# Altium schematic sheet BTL_POWER.SchDoc: BTL_SmartHome
size A4; Organization: HCMUT; Address1: 268 Ly Thuong Kiet; Address2: Dien Hong Ward; Address3: HCMC; Address4: (+84) 98 380 3257; SheetNumber: 2; SheetTotal: 3
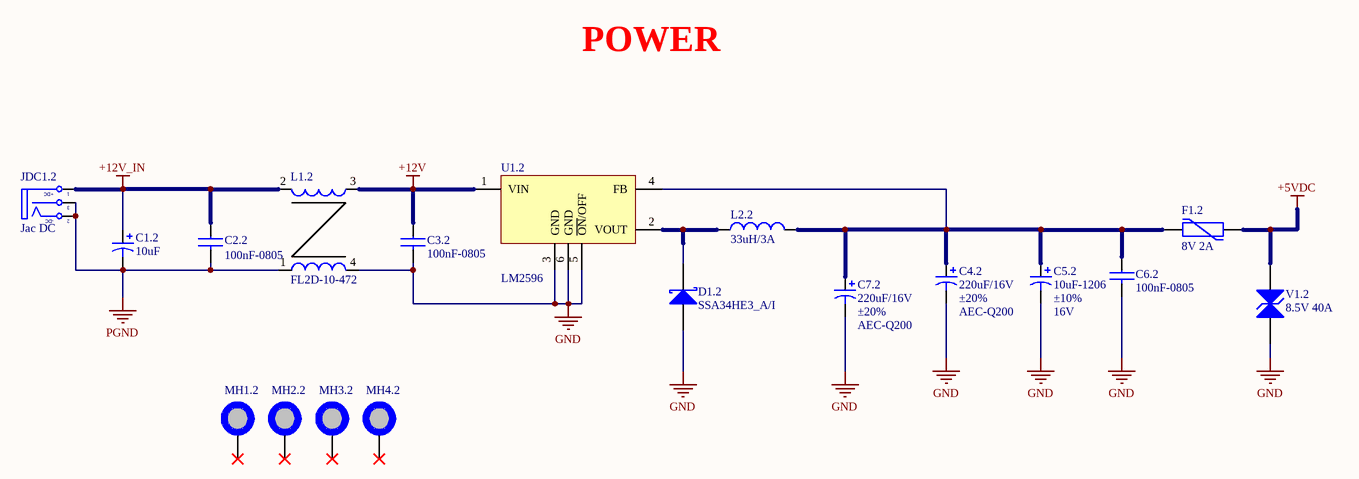
[diagram p0: BTL_POWER.SchDoc]

## Parts
C1.2  10uF  [CAP_ALUMINUM_D8]
C2.2  100nF-0805  [CAP0805]
C3.2  100nF-0805  [CAP0805]
C4.2  220uF/16V  Tolerance: ±20%  Ratings: AEC-Q200  [CAP_ALUMINUM_D8]
C5.2  10uF-1206  Tolerance: ±10%  Voltage - Rated: 16V  [CAP1206_TANTALUM_YELLOW]
C6.2  100nF-0805  [CAP0805]
C7.2  220uF/16V  Tolerance: ±20%  Ratings: AEC-Q200  [CAP_ALUMINUM_D8]
D1.2  SSA34HE3_A/I  [DO-214AC]
F1.2  8V 2A  [FUSE_PTC_SMD1812_03]
JDC1.2  Jac DC  [DC-IN]
L1.2  FL2D-10-472  [INDC_FL2D-10-472]
L2.2  33uH/3A  [INDC_CDRH8D28]
MH1.2  MH_5MMC_3.2MMD  [MH_5MMD_3.2MMD]  (value not drawn)  (no BOM)
MH2.2  MH_5MMC_3.2MMD  [MH_5MMD_3.2MMD]  (value not drawn)  (no BOM)
MH3.2  MH_5MMC_3.2MMD  [MH_5MMD_3.2MMD]  (value not drawn)  (no BOM)
MH4.2  MH_5MMC_3.2MMD  [MH_5MMD_3.2MMD]  (value not drawn)  (no BOM)
U1.2  LM2596  [TO263-5]
V1.2  8.5V 40A  [INDC0805]

## Nets
+5VDC: F1.2.2 V1.2.1
+12V: C3.2.1 L1.2.3 U1.2.1(VIN)
+12V_IN: C1.2.1 C2.2.1 JDC1.2.1(T) L1.2.2
GND: C3.2.2 C4.2.2 C5.2.2 C6.2.2 C7.2.2 D1.2.1(A) L1.2.4 U1.2.3(GND) U1.2.5(~{ON}/OFF) U1.2.6(GND) V1.2.2
PGND: C1.2.2 C2.2.2 JDC1.2.2(TN) JDC1.2.3(S) L1.2.1
NetC4.2_1: C4.2.1 C5.2.1 C6.2.1 C7.2.1 F1.2.1 L2.2.2 U1.2.4(FB)
NetD1.2_2: D1.2.2(K) L2.2.1 U1.2.2(VOUT)

Not connected (* = marked no-connect by the designer): MH1.2 1*; MH2.2 1*; MH3.2 1*; MH4.2 1*

## Notes on the sheet
- POWER
- Title
- Size:
- Date:
- Author:
- A4
- Number:
- Time:
- Checked:
- Revision:
- Sheet
- Approved:
- of
- File:
- (in symbol DCIN) +DC; -DC

## Library data of the parts
C1.2 C4.2 C7.2 = EEE-FK1C470P: CAP ALUM 47UF 20% 16V SMD; Manufacturer: Panasonic Electronic Components; Lifetime @ Temp.: 2000 Hrs @ 105°C; Polarization: Polar; Surface Mount Land Size: 0.260" L x 0.260" W (6.60mm x 6.60mm); Supplier 1: Digi-Key; Manufacturer Part Number: EEE-FK1C470P; RoHS: RoHS Compliant; Category: Capacitors; Stock 1: 97208; Pricing 1: 1=0.51, 10=0.354, 100=0.2123, 500=0.1592 (USD); Packaging: Digi-Reel®; Part Status: Active; ESR (Equivalent Series Resistance): -; Operating Temperature: -55°C ~ 105°C; Applications: Automotive; Lead Spacing: -; Size / Dimension: 0.248" Dia (6.30mm); Height - Seated (Max): 0.240" (6.10mm); Mounting Type: Surface Mount; Package / Case: Radial, Can - SMD; ComponentLink1URL: http://industrial.panasonic.com/www-cgi/jvcr13pz.cgi?E+PZ+3+ABA0120+EEEFK1C470P+7+WW; ComponentLink1Description: http://industrial.panasonic.com/www-cgi/jvcr13pz.cgi?E+PZ+3+ABA0120+EEEFK1C470P+7+WW; Supplier Part Number 1: PCE3790DKR-ND; Value: 47uF
C2.2 C3.2 C6.2 = CC0805JRNPO9BN300: CAP CER 30PF 50V NPO 0805; Manufacturer: Yageo; Tolerance: ±5%; Temperature Coefficient: C0G, NP0; Notification: Current market demand for these product types have resulted in fluctuating and extending lead times. Lead times may differ.; Supplier 1: Digi-Key; Manufacturer Part Number: CC0805JRNPO9BN300; RoHS: RoHS Compliant; Category: Capacitors; Stock 1: 0; Pricing 1: 1=0.15, 10=0.107, 100=0.0503, 500=0.03524, 1000=0.02918 (USD); Packaging: Cut Tape (CT); Part Status: Active; Voltage - Rated: 50V; Operating Temperature: -55°C ~ 125°C; Features: High Voltage; Ratings: -; Applications: General Purpose; Failure Rate: -; Mounting Type: Surface Mount, MLCC; Package / Case: 0805 (2012 Metric); Size / Dimension: 0.079" L x 0.049" W (2.00mm x 1.25mm); Height - Seated (Max): -; Thickness (Max): 0.028" (0.70mm); Lead Spacing: -; Lead Style: -; ComponentLink1URL: http://www.yageo.com/documents/recent/UPY-GP_NP0_16V-to-50V_16.pdf; ComponentLink1Description: http://www.yageo.com/documents/recent/UPY-GP_NP0_16V-to-50V_16.pdf; Supplier Part Number 1: 311-4234-1-ND
C5.2 = T491A106K016AT: CAP TANT 10UF 16V 10% 1206; Manufacturer 1: KEMET; Manufacturer Size Code: A; Category 1: Capacitors; Capacitance: 10µF; Type: Molded; ESR (Equivalent Series Resistance): 7 Ohm; Lifetime @ Temp.: 2000 Hrs @ 85°C; Supplier 1: Digi-Key; Supplier Part Number 1: 399-8269-1-ND; Manufacturer Part Number 1: T491A106K016AT; RoHS 1: RoHS Compliant; Description 1: CAP TANT 10UF 16V 10% 1206; Stock 1: 54083; Pricing 1: 1=0.45, 10=0.312, 100=0.1873, 500=0.14048, 1000=0.11862 (USD); Packaging: Cut Tape (CT); Part Status: Active; Operating Temperature: -55°C ~ 125°C; Mounting Type: Surface Mount; Package / Case: 1206 (3216 Metric); Size / Dimension: 0.126" L x 0.063" W (3.20mm x 1.60mm); Height - Seated (Max): 0.071" (1.80mm); Lead Spacing: -; Features: General Purpose; Failure Rate: -; ComponentLink1URL: http://www.kemet.com/Lists/ProductCatalog/Attachments/254/KEM_T2005_T491.pdf; ComponentLink1Description: http://www.kemet.com/Lists/ProductCatalog/Attachments/254/KEM_T2005_T491.pdf; Value: 10uF
D1.2 = DIODE_SSA34HE3_A/I: DIODE SCHOTTKY 40V 3A DO214AC; Manufacturer 1: Vishay Semiconductor Diodes Division; Category 1: Discrete Semiconductor Products; Voltage - Forward (Vf) (Max) @ If: 490mV @ 3A; Speed: Fast Recovery =< 500ns, > 200mA (Io); Current - Reverse Leakage @ Vr: 200µA @ 40V; Supplier 1: Digi-Key; Supplier Part Number 1: SSA34HE3_A/I-ND; Manufacturer Part Number 1: SSA34HE3_A/I; RoHS 1: RoHS Compliant; Description 1: DIODE SCHOTTKY 40V 3A DO214AC; Stock 1: 0; Pricing 1: 7500=0.13508 (USD); Packaging: Tape & Reel (TR); Part Status: Active; Diode Type: Schottky; Voltage - DC Reverse (Vr) (Max): 40V; Current - Average Rectified (Io): 3A; Capacitance @ Vr, F: -; Mounting Type: Surface Mount; Package / Case: DO-214AC, SMA; Supplier Device Package: DO-214AC (SMA); Operating Temperature - Junction: -65°C ~ 150°C; ComponentLink1URL: http://www.vishay.com/docs/88883/ssa33l.pdf; ComponentLink1Description: http://www.vishay.com/docs/88883/ssa33l.pdf
F1.2 = FUSE_MF-MSMF200-2: PTC RESET FUSE 8V 2A 1812; Manufacturer: Bourns; Number of Terminals/Pins: 2; Max Current Rating: 40A; Power Dissipation: 800mW; Trip Current: 4A; Resistance: 80mR; Time to Trip: 3s; Aging: 1000 hr @ +85 °C (Passive); Approvals: UL,CSA,TUV; Supplier 1: Digi-Key; Supplier Part Number 1: MF-MSMF200-2CT-ND; Manufacturer Part Number: MF-MSMF200-2; RoHS: Yes; Category: Fuses; Stock 1: 15085; Pricing 1: 1=0.67000, 5=0.65000, 10=0.63000, 50=0.53000, 100=0.44000, 250=0.40000, 500=0.33998, 1000=0.29998 (USD); Mount: PCB,Surface Mount; Case/Package: 1812; Number of Pins: 2; Case Code (Metric): 4532; Case Code (Imperial): 1812; Terminal Material: Gold; Min Operating Temperature: -40°C; Max Operating Temperature: 85°C; Hold Current: 2A; Current Rating: 40A; Package Quantity: 2000; Packaging: Tape and Reel; Operating Supply Voltage: 8V; Voltage Rating: 8V; Termination: SMD/SMT; Max Power Dissipation: 800mW; Voltage Rating (DC): 8V; Series: MF-MSMF; Length: 4.73mm; Width: 3.41mm; Height: 0.85mm; Radiation Hardening: No; REACH SVHC: No SVHC; Lead Free: Lead Free; RoHS Compliant: Yes; ComponentLink1URL: https://datasheet.ciiva.com/326/mfmsmf-326966.pdf?src-supplier=Digi-Key; ComponentLink1Description: https://datasheet.ciiva.com/326/mfmsmf-326966.pdf?src-supplier=Digi-Key; ComponentLink2URL: https://datasheet.ciiva.com/326/mfmsmf-326967.pdf?src-supplier=Digi-Key; ComponentLink2Description: https://datasheet.ciiva.com/326/mfmsmf-326967.pdf?src-supplier=Digi-Key; ComponentLink3URL: https://datasheet.ciiva.com/1274/1786007-1274556.pdf?src-supplier=Element14; ComponentLink3Description: https://datasheet.ciiva.com/1274/1786007-1274556.pdf?src-supplier=Element14; ComponentLink4URL: https://datasheet.ciiva.com/1228/1786007-1228163.pdf?src-supplier=Newark; ComponentLink4Description: https://datasheet.ciiva.com/1228/1786007-1228163.pdf?src-supplier=Newark; ComponentLink5URL: https://datasheet.ciiva.com/3020/mfmsmf-3020419.pdf?src-supplier=Avnet; ComponentLink5Description: https://datasheet.ciiva.com/3020/mfmsmf-3020419.pdf?src-supplier=Avnet; ComponentLink6URL: https://datasheet.ciiva.com/326/mfmsmf-326968.pdf?src-supplier=Digi-Key; ComponentLink6Description: https://datasheet.ciiva.com/326/mfmsmf-326968.pdf?src-supplier=Digi-Key; ComponentLink7URL: https://datasheet.ciiva.com/16692/mfmsmf-16692201.pdf?src-supplier=Avnet+Europe; ComponentLink7Description: https://datasheet.ciiva.com/16692/mfmsmf-16692201.pdf?src-supplier=Avnet+Europe; ComponentLink8URL: https://datasheet.ciiva.com/3019/mfmsmf-3019786.pdf?src-supplier=Avnet; ComponentLink8Description: https://datasheet.ciiva.com/3019/mfmsmf-3019786.pdf?src-supplier=Avnet; ComponentLink9URL: https://datasheet.ciiva.com/28411/1786007-28411578.pdf?src-supplier=Element14; ComponentLink9Description: https://datasheet.ciiva.com/28411/1786007-28411578.pdf?src-supplier=Element14; ComponentLink10URL: https://datasheet.ciiva.com/15187/getdatasheetpartid-117210-15187148.pdf?src-supplier=Verical; ComponentLink10Description: https://datasheet.ciiva.com/15187/getdatasheetpartid-117210-15187148.pdf?src-supplier=Verical; ComponentLink11URL: https://datasheet.ciiva.com/1274/1786007-1274557.pdf?src-supplier=Element14; ComponentLink11Description: https://datasheet.ciiva.com/1274/1786007-1274557.pdf?src-supplier=Element14; ComponentLink12URL: https://datasheet.ciiva.com/30196/575mfmsmf-30196429.pdf?src-supplier=Onlinecomponents.com; ComponentLink12Description: https://datasheet.ciiva.com/30196/575mfmsmf-30196429.pdf?src-supplier=Onlinecomponents.com
JDC1.2 = DCIN: Jac DC input; Value: Jac DC
L1.2 = IND_FL2D-10-472: 4.7uH, 1A
L2.2 = IND_CDRH8D28NP-100NC: FIXED IND 10UH 3.2A 47 MOHM SMD; Manufacturer: Sumida America Components Inc.; Material - Core: Ferrite; Tolerance: ±30%; Shielding: Shielded; DC Resistance (DCR): 47 mOhm Max; Supplier 1: Digi-Key; Manufacturer Part Number: CDRH8D28NP-100NC; RoHS: RoHS Compliant; Category: Inductors, Coils, Chokes; Stock 1: 16843; Pricing 1: 1=1.13, 10=1.047, 100=0.7567, 500=0.5796 (USD); Packaging: Cut Tape (CT); Part Status: Active; Type: -; Q @ Freq: -; Ratings: -; Operating Temperature: -40°C ~ 100°C; Mounting Type: Surface Mount; Package / Case: Nonstandard; Supplier Device Package: -; Size / Dimension: 0.315" L x 0.315" W (8.00mm x 8.00mm); Height - Seated (Max): 0.118" (3.00mm); ComponentLink1URL: http://products.sumida.com/products/pdf/CDRH8D28.pdf; ComponentLink1Description: http://products.sumida.com/products/pdf/CDRH8D28.pdf; Supplier Part Number 1: 308-1658-1-ND; Value: 10uH
MH1.2 MH2.2 MH3.2 MH4.2 = MH_5MMC_3.2MMD: Mounting Hole 5mm Diameter, 3.2mm Drill
U1.2 = LM2596: 1A Regulator
V1.2 = VARISTOR_VC080505A150RP: VARISTOR 8.5V 40A 0805; Manufacturer: Kyocera AVX; Number of Terminals/Pins: 2; Capacitance: 1.1nF; Max Voltage Rating (AC): 4V; Max Voltage Rating (DC): 5.6V; Clamping Current: 1A; Clamping Voltage: 18V; Number of Circuits: 1; Energy: 0.1J; ESD Protection: Yes; Voltage Tolerance: 20%; Min Varistor Voltage: 6.8V; Max Varistor Voltage: 10.2V; Current Rating: 1mA; Supplier 1: Digi-Key; Supplier Part Number 1: 478-11137-2-ND; Manufacturer Part Number: VC080505A150RP; RoHS: Yes; Category: Varistors; Pricing 1: 4000=0.11550, 8000=0.10850, 12000=0.10150, 28000=0.09310 (USD); Mount: Surface Mount; Case/Package: 0805; Case Code (Imperial): 0805; Case Code (Metric): 2012; Material: Ceramic; Contact Plating: Tin,Matte; Min Operating Temperature: -55°C; Max Operating Temperature: 125°C; Varistor Voltage: 8.5V; Max Surge Current: 40A; Voltage Rating: 5.6V; Voltage Rating (AC): 4V; Voltage Rating (DC): 5.6V; Packaging: Tape and Reel; Max Output Current: 40A; Package Quantity: 4000; Termination: SMD/SMT; Operating Supply Voltage: 5.6V; Length: 2.01mm; Width: 1.25mm; Depth: 1.25mm; REACH SVHC: No SVHC; Lead Free: Lead Free; RoHS Compliant: Yes; ComponentLink1URL: https://datasheet.ciiva.com/34302/1155151-34302026.pdf?src-supplier=Jameco; ComponentLink1Description: https://datasheet.ciiva.com/34302/1155151-34302026.pdf?src-supplier=Jameco; ComponentLink2URL: https://datasheet.ciiva.com/3024/tguard-3024149.pdf?src-supplier=Avnet; ComponentLink2Description: https://datasheet.ciiva.com/3024/tguard-3024149.pdf?src-supplier=Avnet; ComponentLink3URL: https://datasheet.ciiva.com/7971/tguard-7971624.pdf?src-supplier=Element14; ComponentLink3Description: https://datasheet.ciiva.com/7971/tguard-7971624.pdf?src-supplier=Element14; ComponentLink4URL: https://datasheet.ciiva.com/369/tguard-369629.pdf?src-supplier=Digi-Key; ComponentLink4Description: https://datasheet.ciiva.com/369/tguard-369629.pdf?src-supplier=Digi-Key